# EAGLE design Stator_PCB_ver_1.3 (EAGLE 7.4.0)
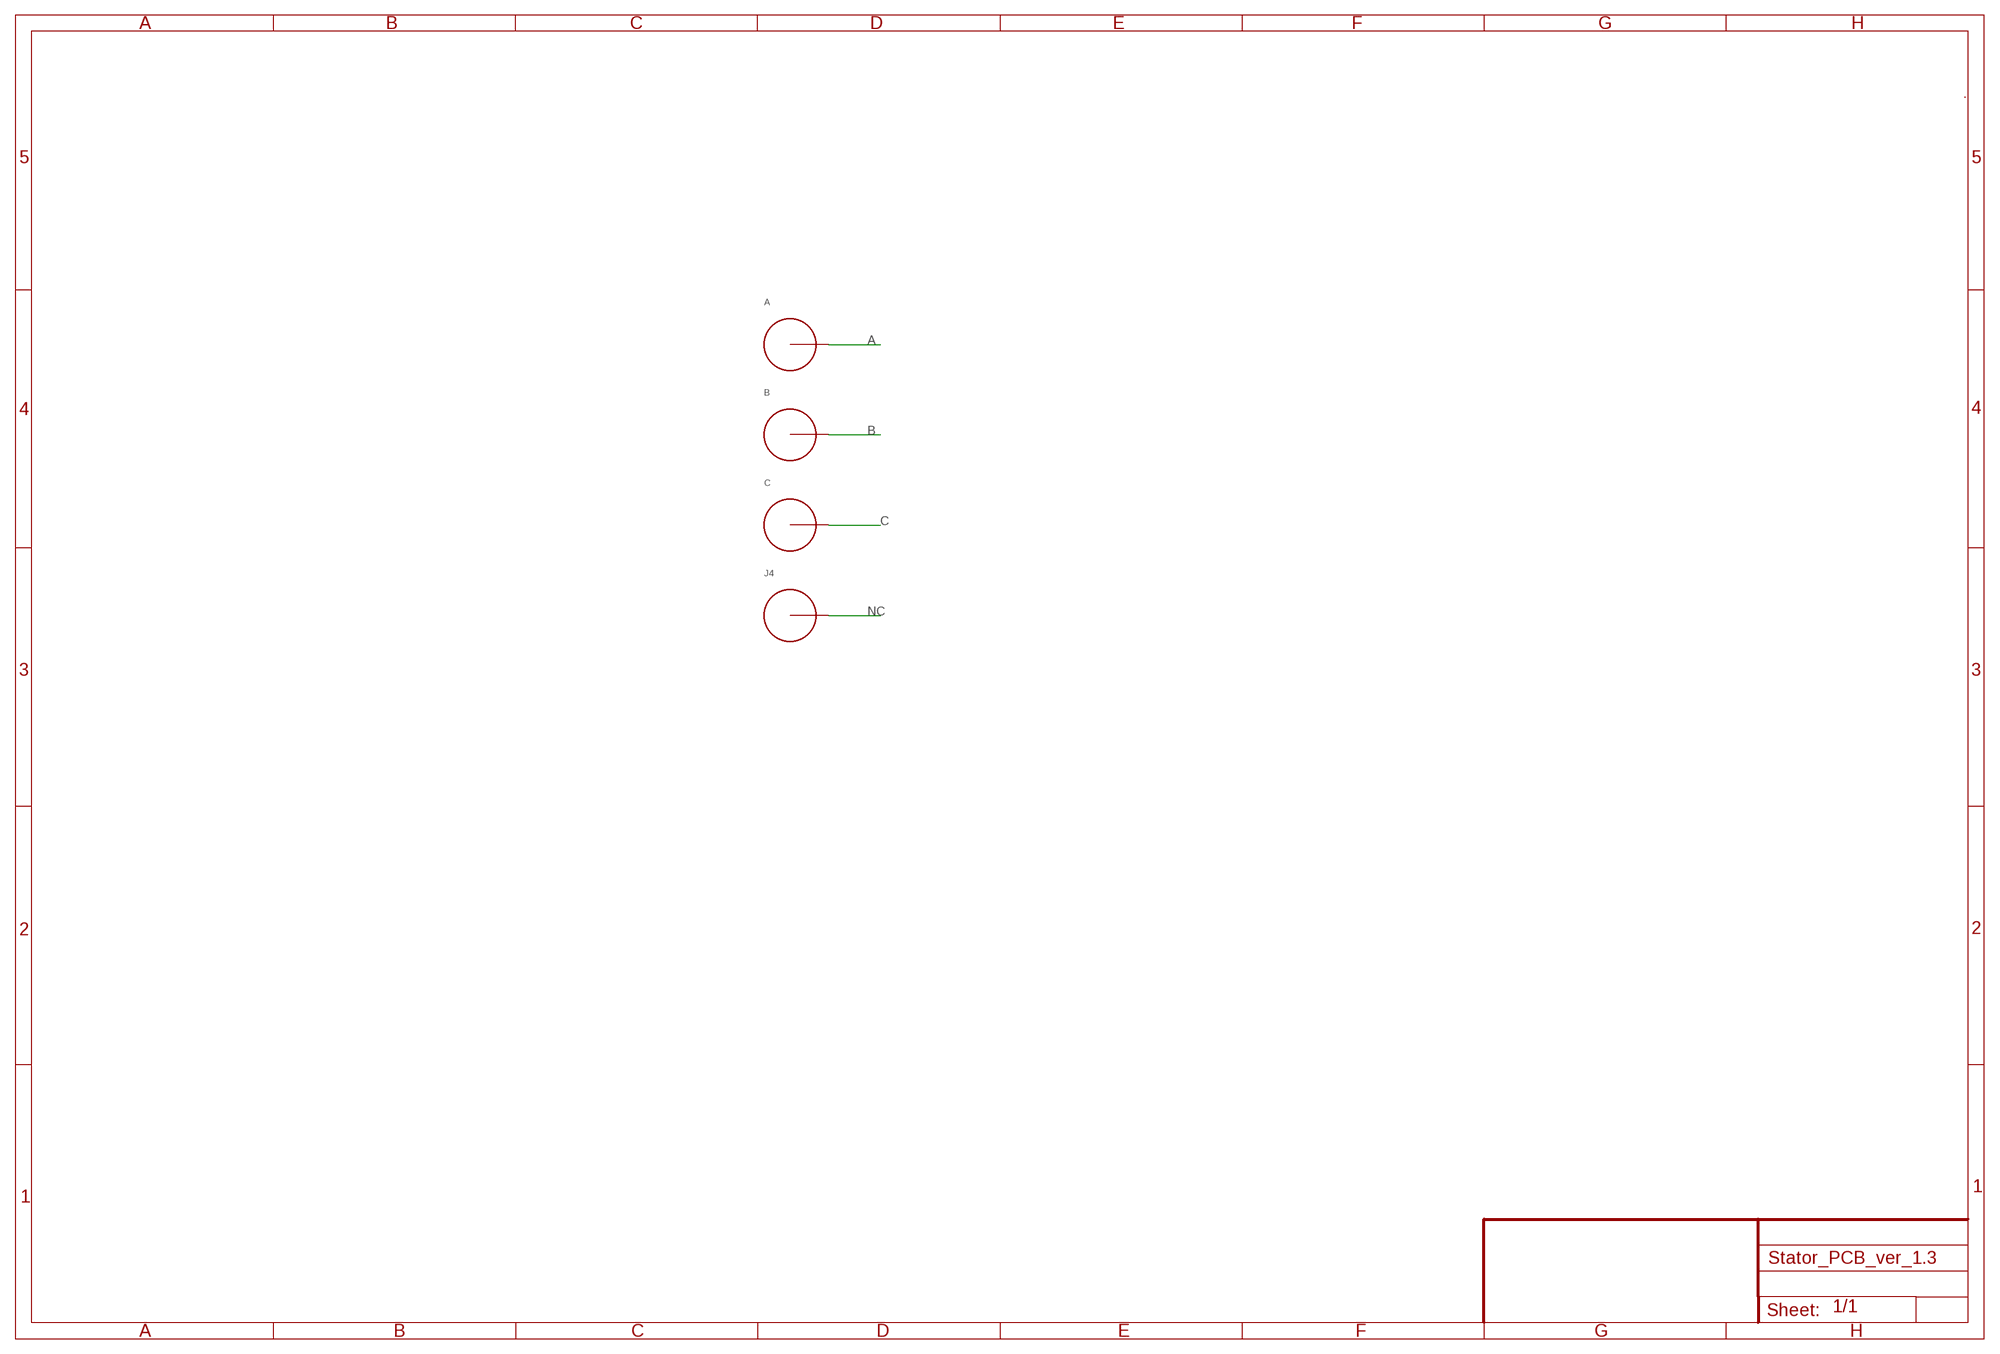
[diagram p0: schematic, sheet 1]

## Parts
A  48834883  [4883]
B  48834883  [4883]
C  48834883  [4883]
J4  48834883  [4883]

## Nets
A: A.P$1
B: B.P$1
C: C.P$1
NC: J4.P$1

## Library data of the parts
A B C J4 = KEYSTONE:4883

## Board
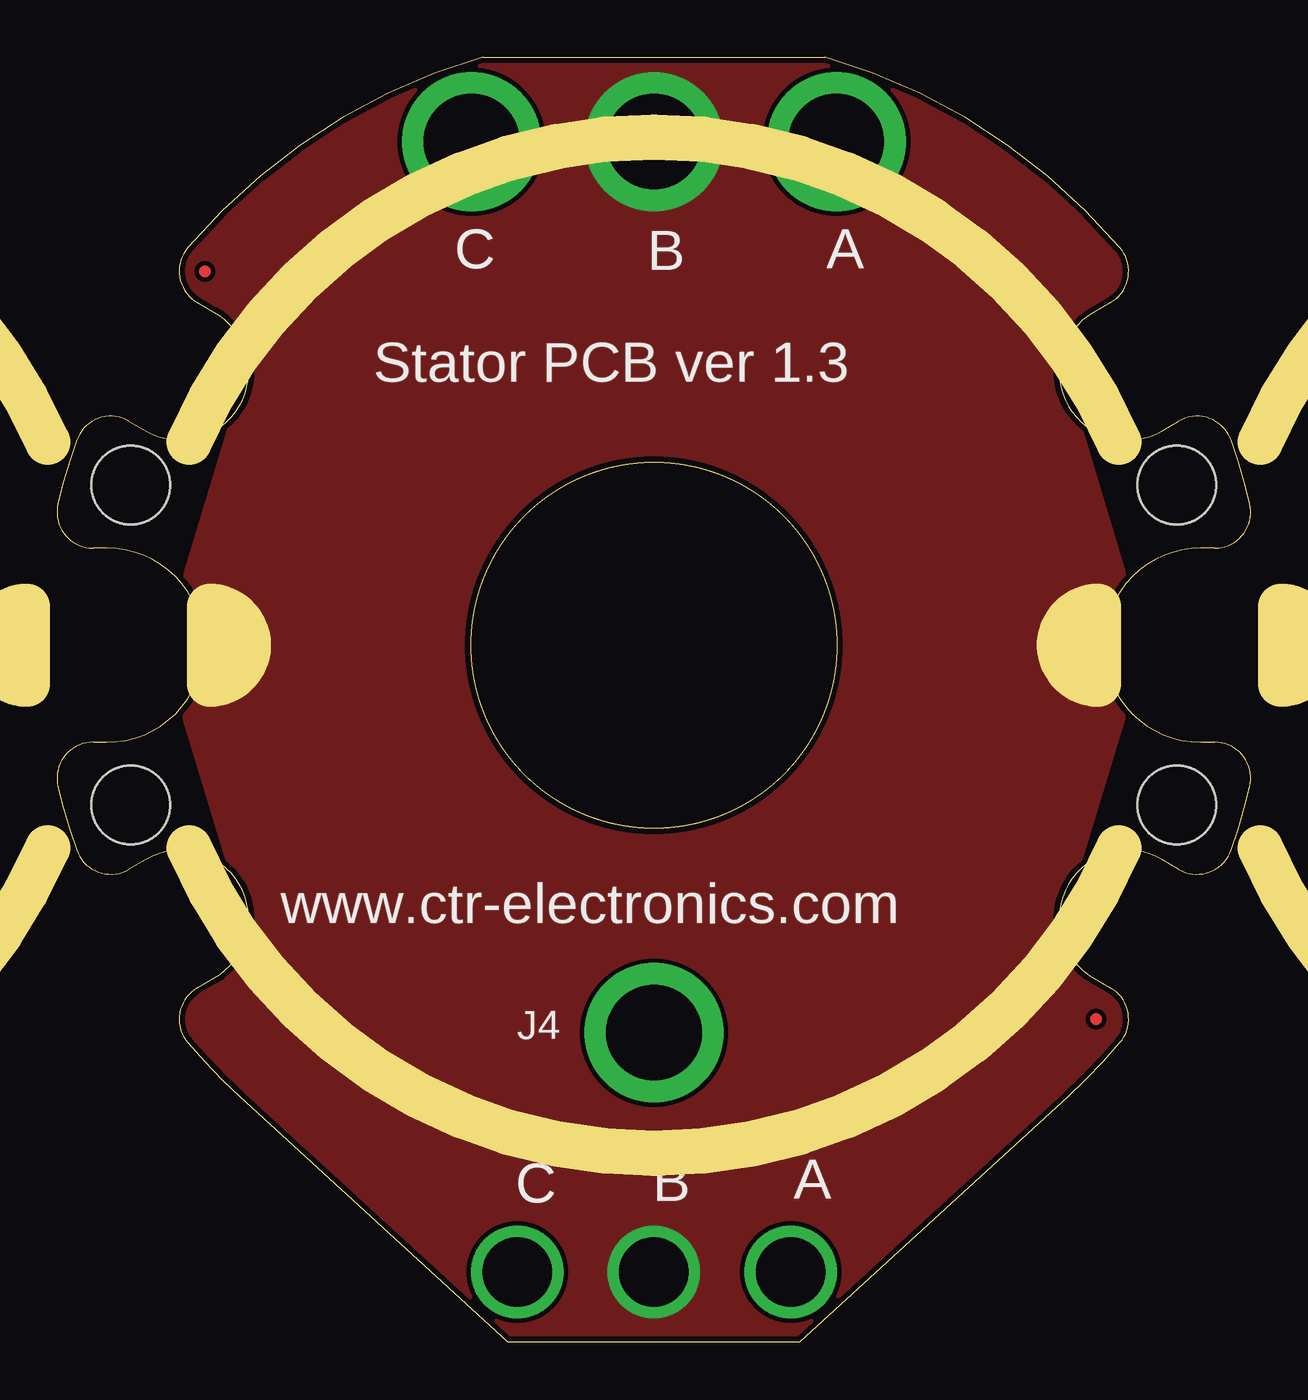
[diagram p1: board, top side]
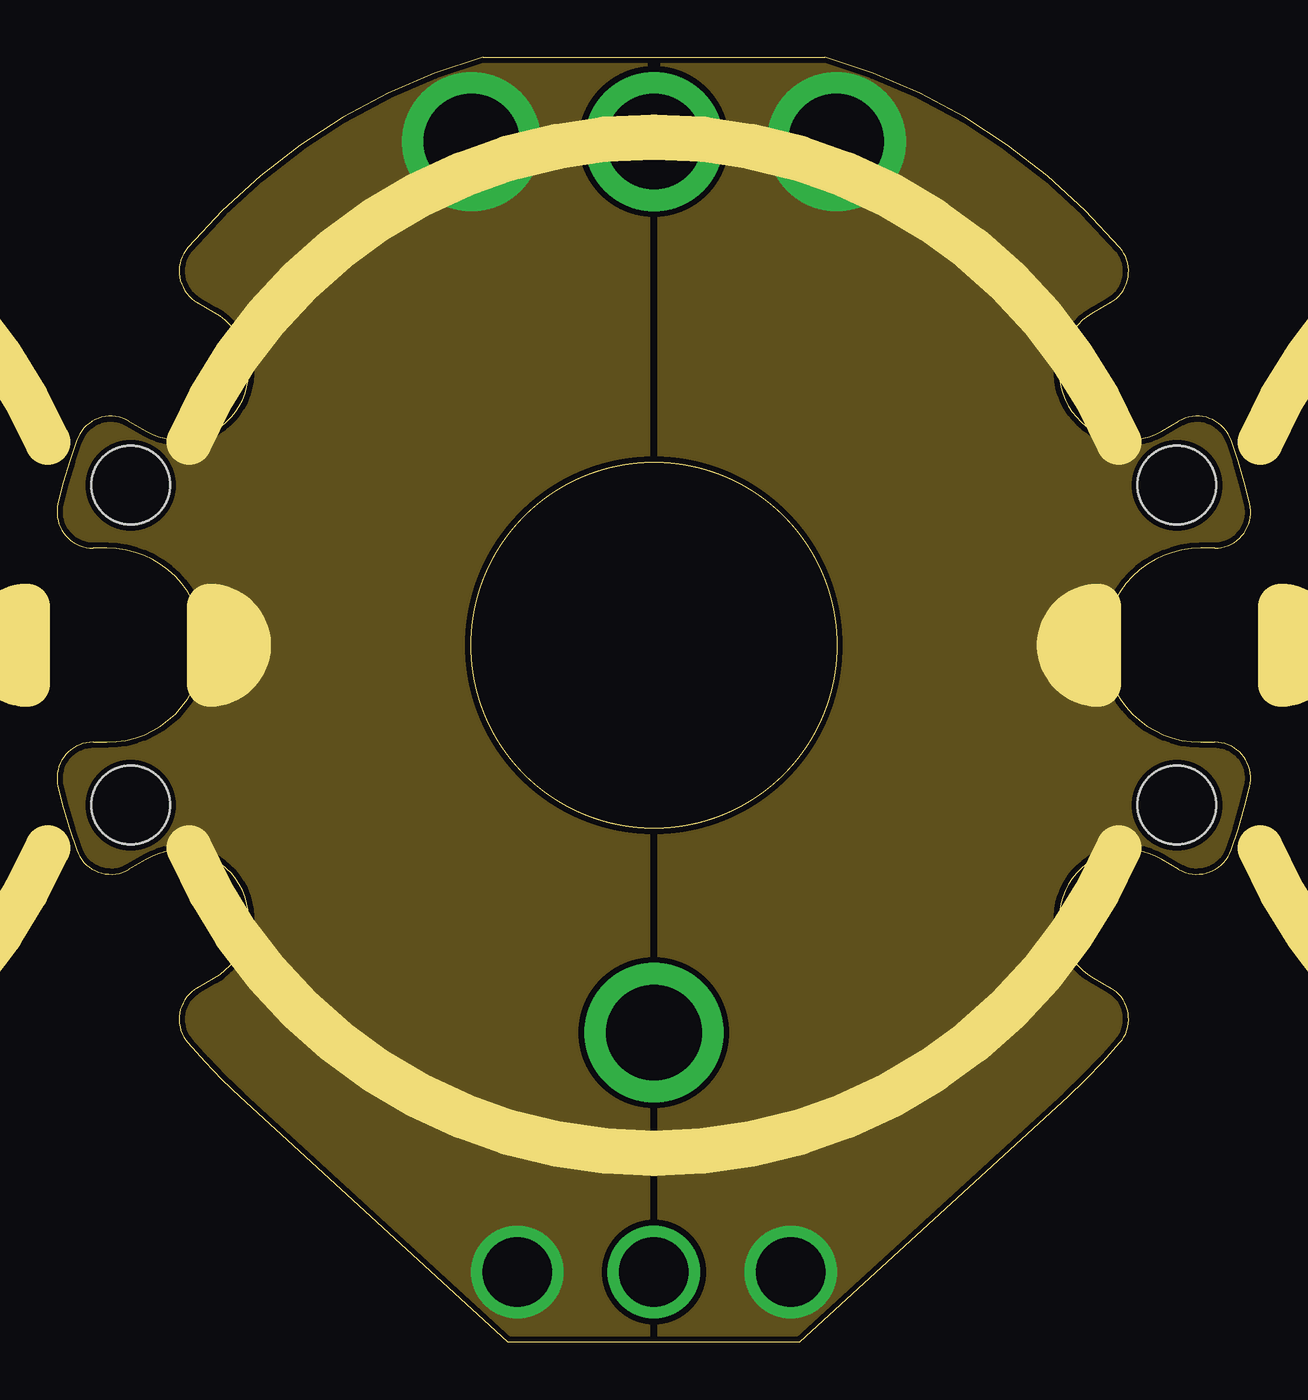
[diagram p2: board, inner layer Route2]
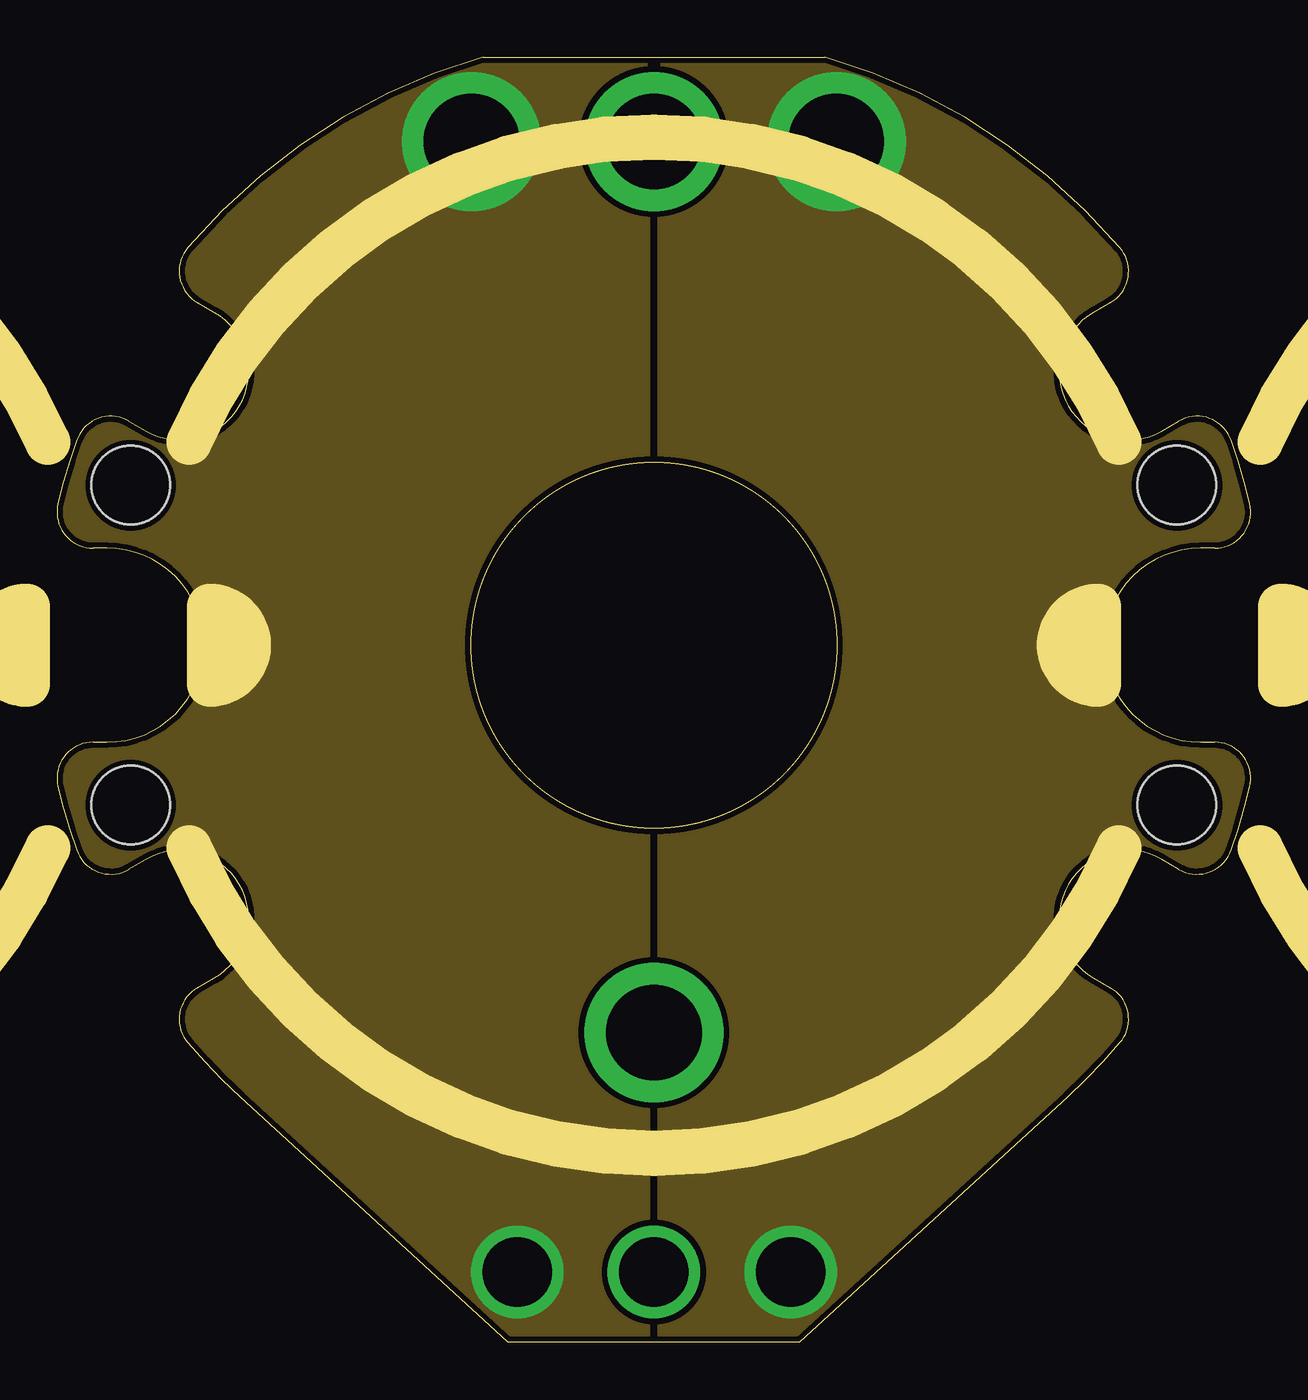
[diagram p3: board, inner layer Route3]
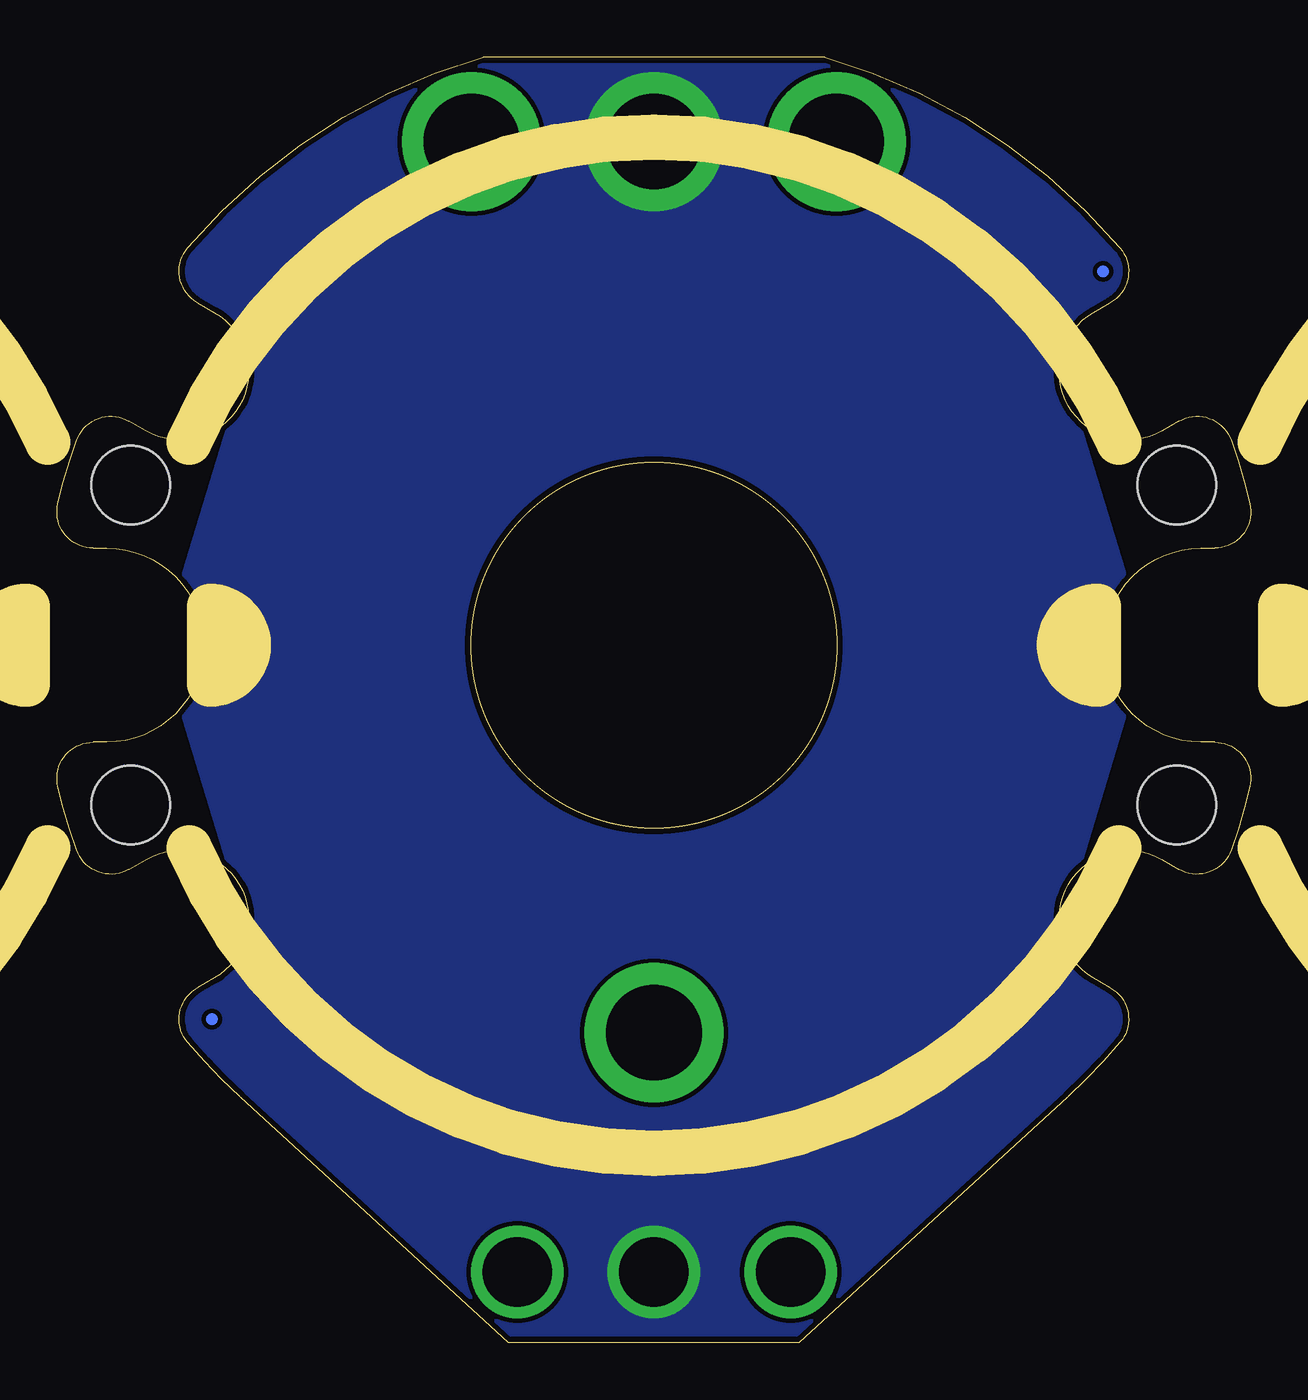
[diagram p4: board, bottom side, seen from below]

Size 52.38 x 56.4 mm. Coordinates in mm from the lower left corner, seen from the top.
Outline: 18.69,56.4 33.69,56.4 arc-33 46.64,48.03 arc-100 46.23,45.63 45.47,45.19 arc180 48.47,40 49.23,40.43 arc-100 51.52,39.59 arc-6 52.34,36.8 arc-103 50.79,34.85 50.19,34.85 arc180 50.19,26.34 50.79,26.34 arc-103 52.34,24.39 arc-6 51.52,21.6 arc-100 49.23,20.76 48.47,21.19 arc180 45.47,16 46.23,15.56 arc-100 46.64,13.16 arc-7 44.35,10.78 32.58,0 19.8,0 8.03,10.78 arc-7 5.74,13.16 arc-100 6.15,15.56 6.9,16 arc180 3.9,21.19 3.15,20.76 arc-100 0.86,21.6 arc-6 0.04,24.39 arc-103 1.59,26.34 2.19,26.34 arc180 2.19,34.85 1.59,34.85 arc-103 0.04,36.8 arc-6 0.86,39.59 arc-100 3.15,40.43 3.9,40 arc180 6.9,45.19 6.15,45.63 arc-100 5.74,48.03 arc-33 18.69,56.4
Outline: circle at 26.19,30.59 radius 8.03
Copper layers (1+2*3+16): Top 0.07mm / dielectric 6mil / Route2 0.07111875mm / dielectric 0.99821875mm / Route3 0.035mm / dielectric 6mil / Bottom 0.035mm
Design rules "default *": minimum track width 7mil, minimum drill 8mil, track to track 0.1968mm, track to pad 0.1968mm, pad to pad 0.1968mm, via to via 0.1968mm, smd to smd 0.1968mm, copper to edge 10mil, drill to drill 8mil, minimum pad ring 5mil, minimum via ring 5mil, stop-mask expansion 2mil, vias tented up to drill 20mil, thermal gap 10mil
Holes 3.45 mm at 3.24,37.61 3.24,23.58 49.14,23.58 49.14,37.61
tRestrict: area 0.2,20.5 to 6.3,26.6; area 0.2,34.6 to 6.3,40.7; area 46.1,34.6 to 52.2,40.7; area 46.1,20.5 to 52.2,26.6; 4 lines
bRestrict: area 0.2,34.6 to 6.3,40.7; area 0.2,20.5 to 6.3,26.6; area 46.1,20.5 to 52.2,26.6; area 46.1,34.6 to 52.2,40.7; 4 lines
Milling: 24 lines

### Footprints (pad centres in the part's own frame; a part is rotated, then mirrored left to right if it is on the bottom)
4883 = drill 4.2 pad 6.1: P$1 0,0

### Placement (x,y rotation side)
A  34.19,52.69 65 top
B  26.19,52.69 90 top
C  18.19,52.69 110 top
J4  26.19,13.59 0 top
U$1  [20_MIL_FID]  45.59,14.19 0 top
U$2  [20_MIL_FID]  6.49,46.99 0 top

### Tracks (layer width: path | path; a pad name or v marks a point on that pad's centre or on a via)
A  (via drill 3.05 pad 4)
  other vias: 32.19,3.09
  pour Route2 (isolate 0.254, no thermals): 26.44,56.91 53.29,56.91 53.29,-0.14 26.44,-0.14
  pour Route3 (isolate 0.254, no thermals): 26.44,56.91 53.29,56.91 53.29,-0.14 26.44,-0.14
B  (via drill 3.05 pad 4)
  other vias: 26.19,3.09
  pour Bottom (no thermals): -0.12,56.91 53.29,56.91 53.29,-0.14 -0.12,-0.14
  pour Top (no thermals): -0.73,56.81 -0.73,-0.5 52.66,-0.5 52.66,56.81
C  (via drill 3.05 pad 4)
  other vias: 20.19,3.09
  pour Route2 (isolate 0.254, no thermals): -0.12,56.91 25.94,56.91 25.94,-0.14 -0.12,-0.14
  pour Route3 (isolate 0.254, no thermals): -0.12,56.91 25.94,56.91 25.94,-0.14 -0.12,-0.14

### Text on the board
tPlace: Stator PCB ver 1.3 | www.ctr-electronics.com
tNames: C | B | A
Panel: ALL DIMENSIONS ARE IN MILS | V-SCORE | ROUTED AREA | HOLES